# Altium schematic sheet C8.SchDoc
size A4
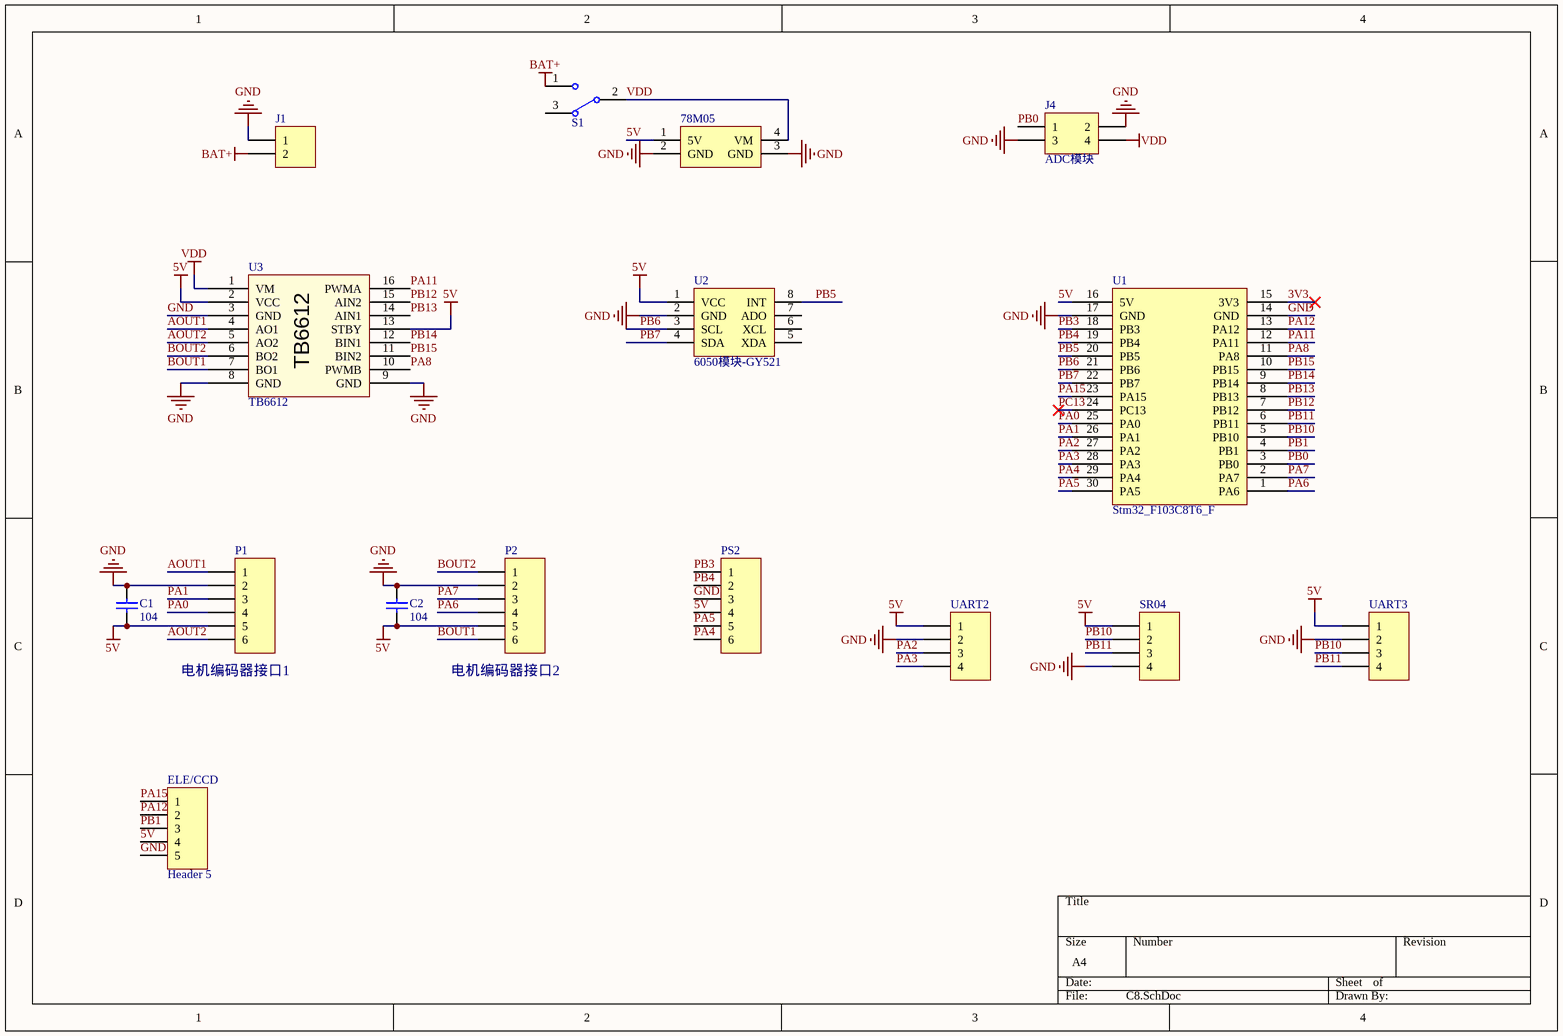
[diagram p0: C8.SchDoc]

## Parts
78M05  78M05  [MP2259_M0]  (value not drawn)
C1  104  [MLCC5.08-A]
C2  104  [MLCC5.08-A]
ELE/CCD  Header 5  [XH2.54-LI-5P]
J1  Header 2  [XT30-PW-M]  (value not drawn)
J4  ADC模块  [ADC_A0]
P1  Header 6  [XH2.54-WI-6P]  (value not drawn)
P2  Header 6  [XH2.54-WI-6P]  (value not drawn)
PS2  Header 6  [XH2.54-LI-6P]  (value not drawn)
S1  SW-SPDT  [SW]  (value not drawn)
SR04  Header 4  [HDR1X4]  (value not drawn)
U1  Stm32_F103C8T6_F  [Stm32_F103C8T6_F]
U2  6050模块-GY521  [MPU6050_B1]
U3  TB6612  [TB6612模块]
UART2  Header 4  [HDR1X4]  (value not drawn)
UART3  Header 4  [HDR1X4]  (value not drawn)

## Nets
5V: 78M05.1(5V) C1.1 C2.1 ELE/CCD.4 P1.5 P2.5 PS2.4 SR04.1 U1.16(5V) U2.1(VCC) U3.2(VCC) U3.13(STBY) UART2.1 UART3.1
BAT+: J1.2 S1.1
GND: 78M05.2(GND) 78M05.3(GND) C1.2 C2.2 ELE/CCD.5 J1.1 J4.2 J4.3 P1.2 P2.2 PS2.3 SR04.4 U1.14(GND) U1.17(GND) U2.2(GND) U3.3(GND) U3.8(GND) U3.9(GND) UART2.2 UART3.2
VDD: 78M05.4(VM) J4.4 S1.2 U3.1(VM)
3V3: U1.15(3V3)
AOUT1: P1.1 U3.4(AO1)
AOUT2: P1.6 U3.5(AO2)
BOUT1: P2.6 U3.7(BO1)
BOUT2: P2.1 U3.6(BO2)
PA0: P1.4 U1.25(PA0)
PA1: P1.3 U1.26(PA1)
PA2: U1.27(PA2) UART2.3
PA3: U1.28(PA3) UART2.4
PA4: PS2.6 U1.29(PA4)
PA5: PS2.5 U1.30(PA5)
PA6: P2.4 U1.1(PA6)
PA7: P2.3 U1.2(PA7)
PA8: U1.11(PA8) U3.10(PWMB)
PA11: U1.12(PA11) U3.16(PWMA)
PA12: ELE/CCD.2 U1.13(PA12)
PA15: ELE/CCD.1 U1.23(PA15)
PB0: J4.1 U1.3(PB0)
PB1: ELE/CCD.3 U1.4(PB1)
PB3: PS2.1 U1.18(PB3)
PB4: PS2.2 U1.19(PB4)
PB5: U1.20(PB5) U2.8(INT)
PB6: U1.21(PB6) U2.3(SCL)
PB7: U1.22(PB7) U2.4(SDA)
PB10: SR04.2 U1.5(PB10) UART3.3
PB11: SR04.3 U1.6(PB11) UART3.4
PB12: U1.7(PB12) U3.15(AIN2)
PB13: U1.8(PB13) U3.14(AIN1)
PB14: U1.9(PB14) U3.12(BIN1)
PB15: U1.10(PB15) U3.11(BIN2)
PC13: U1.24(PC13)

Not connected (* = marked no-connect by the designer): S1 3; U2 5(XDA) 6(XCL) 7(ADO)

## Notes on the sheet
- (near P1) 电机编码器接口1
- (near P2) 电机编码器接口2

## Library data of the parts
78M05 = MP2259模块
C1 C2 = Cap: Capacitor; Value: 0.1uF; Published: 8-Jun-2000; LatestRevisionDate: 17-Jul-2002; LatestRevisionNote: Re-released for DXP Platform.; PackageReference: RAD-0.3; Publisher: Altium Limited; PackageDescription: Radial Cap, Thru-Hole; 2 Leads; 0.3 in Pin Spacing
ELE/CCD = Header 5: Header, 5-Pin; LatestRevisionDate: 17-Jul-2002; LatestRevisionNote: Re-released for DXP Platform.; Publisher: Altium Limited
J1 = Header 2: Header, 2-Pin; LatestRevisionDate: 17-Jul-2002; LatestRevisionNote: Re-released for DXP Platform.; Publisher: Altium Limited
J4 = Header 2X2: Header, 2-Pin, Dual row; LatestRevisionDate: 17-Jul-2002; LatestRevisionNote: Re-released for DXP Platform.; Publisher: Altium Limited
P1 P2 PS2 = Header 6: Header, 6-Pin; LatestRevisionDate: 17-Jul-2002; LatestRevisionNote: Re-released for DXP Platform.; Publisher: Altium Limited
S1 = SW-SPDT: SPDT Subminiature Toggle Switch, Right Angle Mounting, Vertical Actuation; Published: 24-Mar-1999; LatestRevisionDate: 17-Dec-2003; LatestRevisionNote: Schematic revised, PCB Footprint replaced.; DatasheetVersion: 05-Dec-2000; PackageReference: TL36WW15050; Publisher: Altium Limited; PackageDescription: Switch; 4 Leads; ComponentLink1Description: Manufacturer Link; ComponentLink1URL: http://www.apem.com
SR04 UART2 UART3 = Header 4: Header, 4-Pin; LatestRevisionDate: 17-Jul-2002; LatestRevisionNote: Re-released for DXP Platform.; Publisher: Altium Limited
U3 = DAYU_TB6612